# EasyEDA schematic 1-Schematic_P1_ElectricalManagement_MechanicalRelay.json
TITLE: P1_ElectricalManagement_MechanicalRelay; REV: 1.0; Date: 2019-07-15; Sheet: 1/1; Drawn By: Francisco Moreno; Company: Universidad de Sevilla
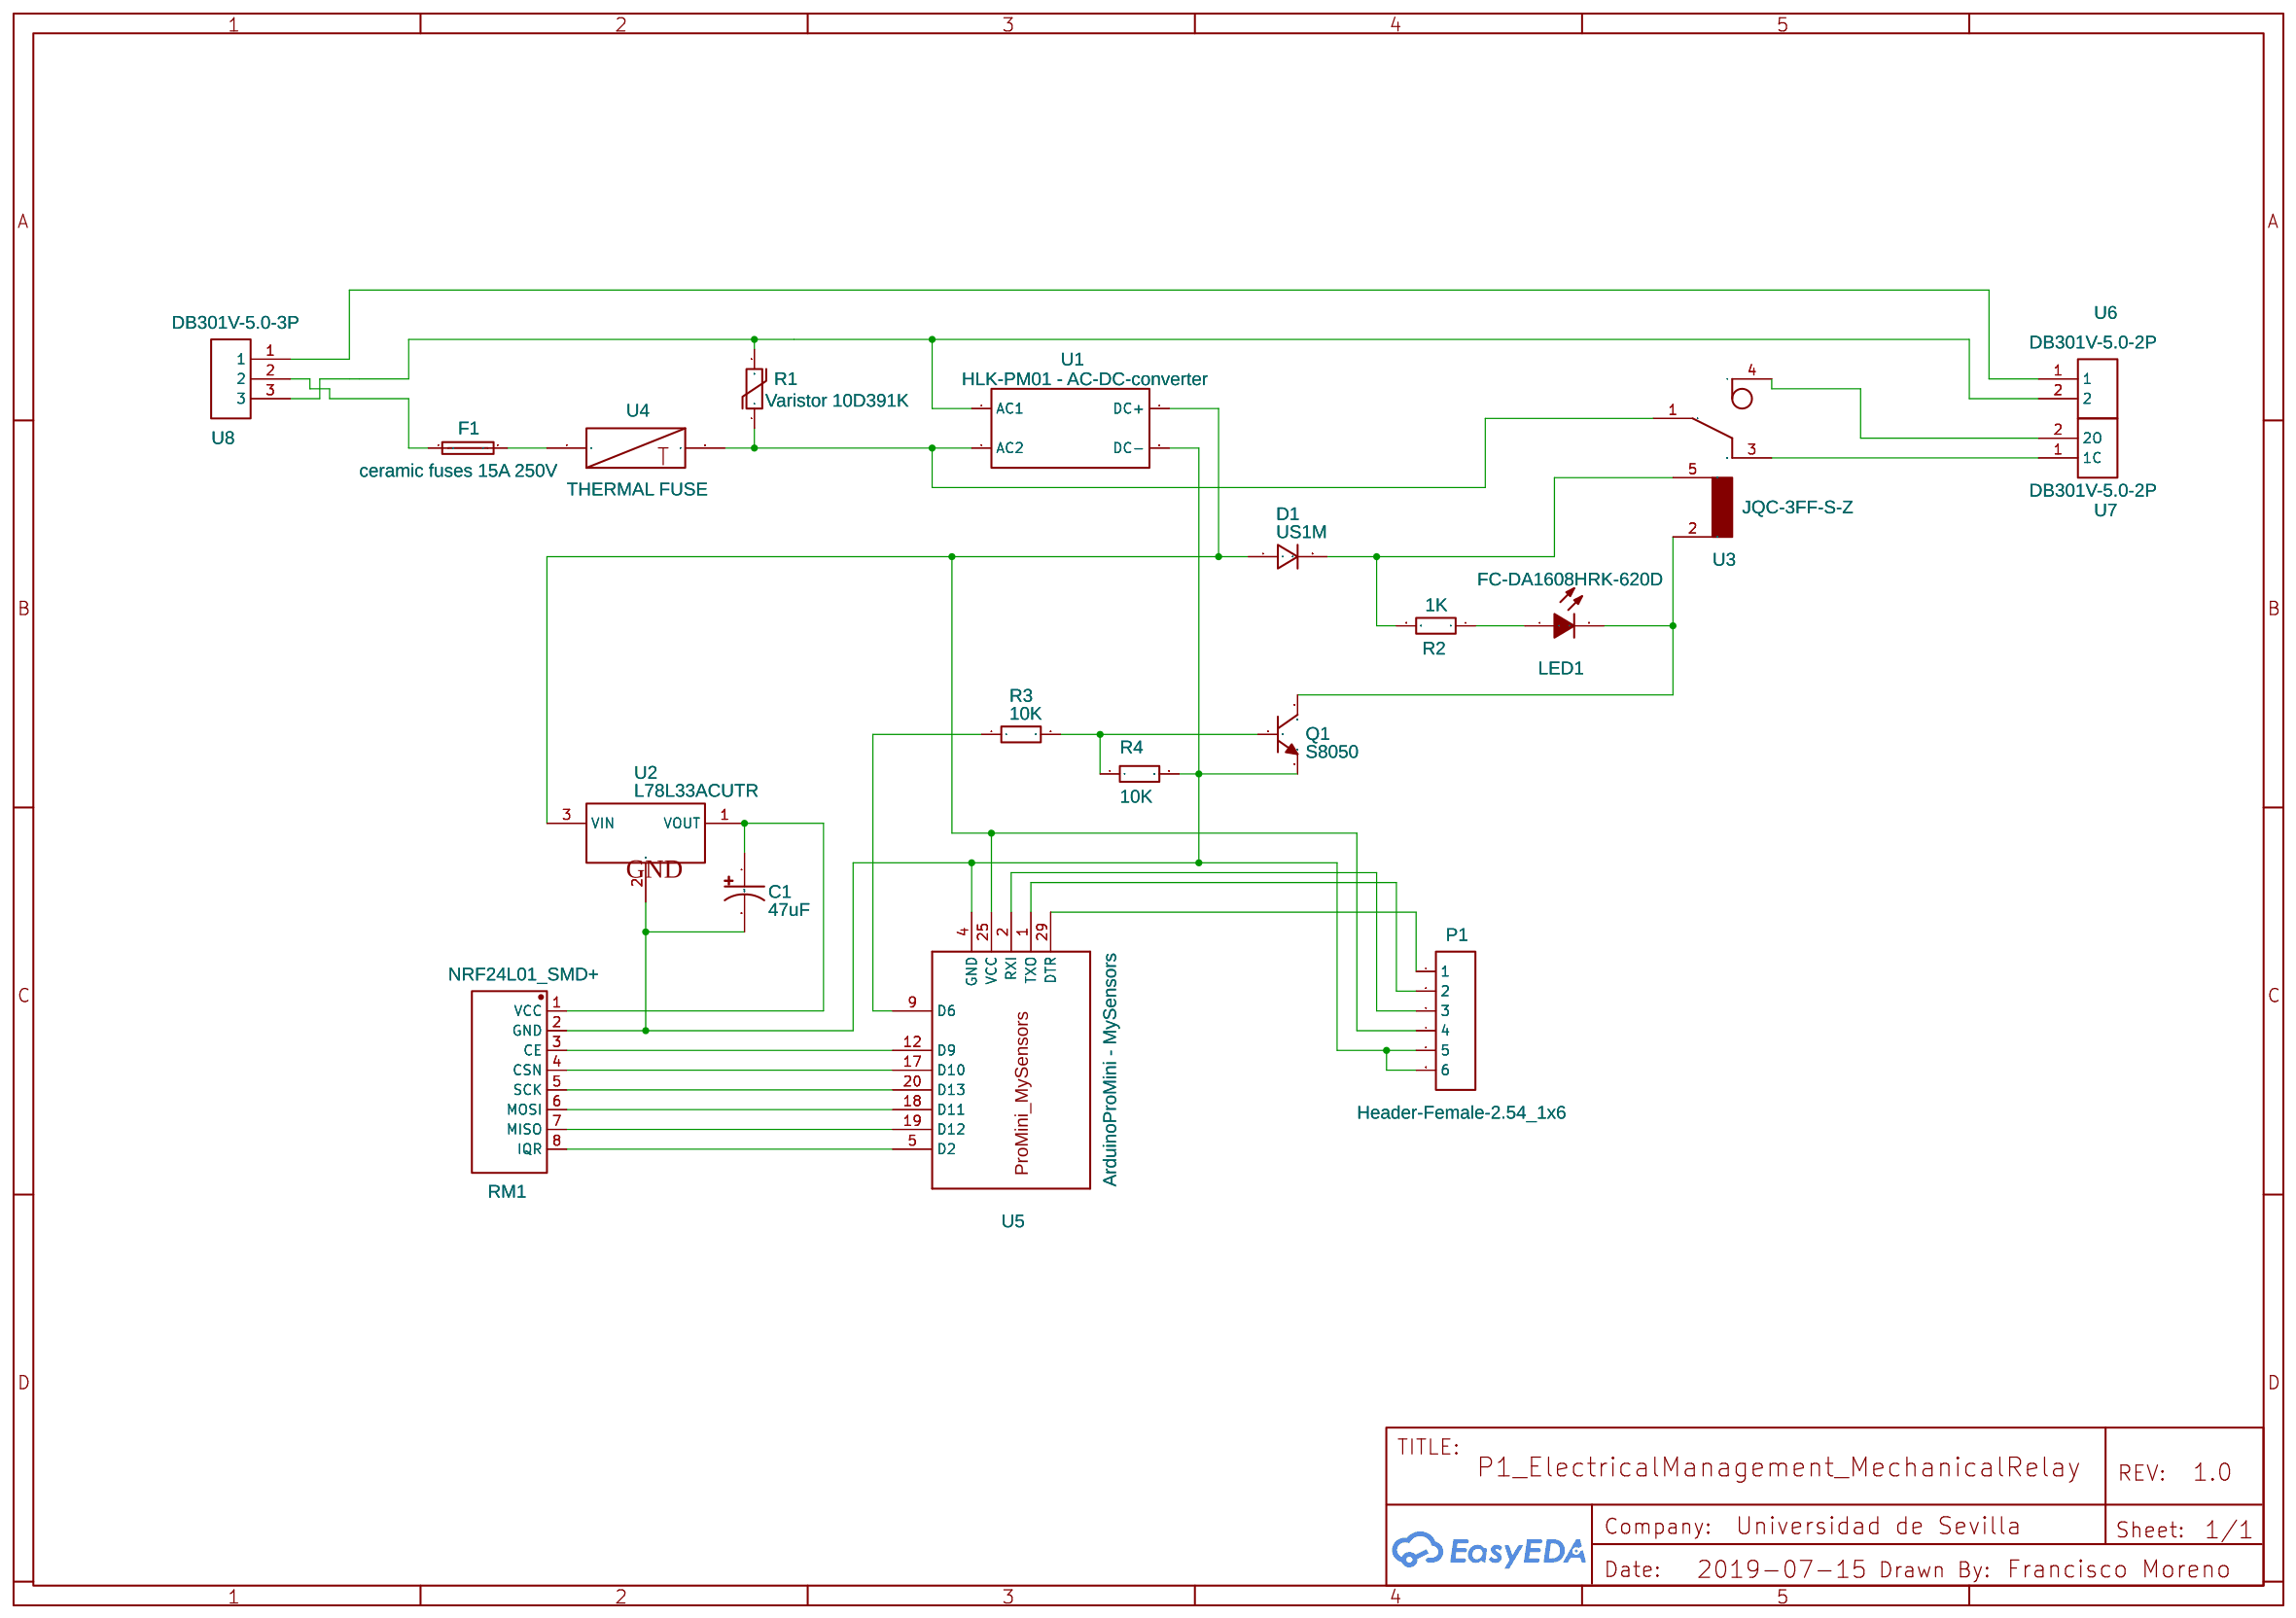
[diagram p0: schematic sheet]

## Parts
C1  47uF  [SMD,6.3X5.4MM]
D1  US1M  [SMA(DO-214AC)]
F1  ceramic fuses 15A 250V  [F-DIP-22.5X5.8]
LED1  FC-DA1608HRK-620D  [LED-0603]
P1  Header-Female-2.54_1x6  [HDR-6X1/2.54]
Q1  S8050  [SOT-23(SOT-23-3)]
R1  Varistor 10D391K  [VDR-7.5-12.5X8]
R2  1K  [BEAD_0805]
R3  10K  [0805]
R4  10K  [0805]
RM1  NRF24L01_SMD+  [NRF24L01_SMD+]
U1  HLK-PM01 - AC-DC-converter  [HLK-PM01]
U2  L78L33ACUTR  [SOT-89]
U3  JQC-3FF-S-Z  [JQC-3FF-S-Z]
U4  THERMAL FUSE  [THERMAL FUSE]
U5  ArduinoProMini - MySensors  [PROMINI_MYSENSORS_PINS]
U6  DB301V-5.0-2P  [WJ301V-5.00-2P]
U7  DB301V-5.0-2P  [WJ301V-5.00-2P]
U8  DB301V-5.0-3P  [WJ301V-5.00-3P]

## Library data of the parts
C1 = RT1V470M0605: Supplier: LCSC; Supplier Part: C267463; Manufacturer: ROQANG; Contributor: LCSC
D1 = -: Supplier Part: C9808; Supplier: LCSC; Manufacturer: Semtech; Manufacturer Part: LL4148; Contributor: LCSC
F1 = -: Supplier: LCSC; Manufacturer Part: 20N-150H; Manufacturer: HOLLY; image: //image.lceda.cn/szlcsc/C60547.jpg; Supplier Part: C377301
LED1 = -: Supplier: LCSC; Manufacturer: NATIONSTAR; Supplier Part: C84263
P1 = -: Supplier: LCSC; Manufacturer: BOOMELE; Manufacturer Part: Female header 1*6p; Supplier Part: C40877
Q1 = -: Supplier: LCSC; Manufacturer: Hottech; Contributor: LCSC; Supplier Part: C181158; LCSC Assembly: Yes; SMT Type: Extend
R1 = 10D391K_C233184: Supplier: LCSC; Supplier Part: C233184; Manufacturer: Shenzhen Ruilongyuan Elec; Manufacturer Part: 10D391K; Contributor: LCSC
R2 = 1206W4J0102T5E: Supplier: LCSC; Manufacturer: UniOhm; Supplier Part: C1469
R3 R4 = RS-05K103JT: Supplier: LCSC; Manufacturer: FH; Supplier Part: C115295
RM1 = -: Supplier: LCSC; Manufacturer Part: ?; Contributor: tiana
U1 = -: sourceId: u1BzxTRca; Manufacturer Part: ?
U2 = -: Supplier: LCSC; Manufacturer: STMicroelectronics; image: //image.lceda.cn/szlcsc/C14170.jpg; Supplier Part: C14170; LCSC Assembly: Yes; SMT Type: Extend
U3 = -: Contributor: EasyEDA; link: https://www.alibaba.com/product-detail/relay-types-JQC-3FF-S-Z_60682592473.html
U4 = -: Supplier Part: DF72S; Supplier: ESKA; Contributor: j.arts87; Link: https://www.alibaba.com/product-detail/DF72S-72c-thermal-fuse-16a-250v_60653461804.html?spm=a2700.7724857.normalList.2.2c201c68Es4QP8&s=p
U5 = -: Manufacturer Part: New SchematicLib; Contributor: buinskii; Link: https://robotdyn.ru/catalog/arduino/boards/promini_atmega328p_compatible_with_arduino_mini.html
U6 U7 = -: Manufacturer: DIBO; Supplier: LCSC; Supplier Part: C395882; link: https://datasheet.lcsc.com/szlcsc/1906111836_DIBO-DB301V-5-0-3P_C395881.pdf; Contributor: framortej
U8 = -: Manufacturer: DIBO; Supplier: LCSC; Supplier Part: C395881; link: https://datasheet.lcsc.com/szlcsc/1906111836_DIBO-DB301V-5-0-3P_C395881.pdf; Contributor: alexgubanow

## Nets
Net-(C1-1): C1.1 RM1.1(VCC) U2.1(VOUT)
Net-(C1-2): C1.2 P1.5 P1.6 Q1.2 R4.2 RM1.2(GND) U1.3(DC-) U2.2(GND) U5.4(GND)
Net-(D1-1): D1.1 P1.4 U1.4(DC+) U2.3(VIN) U5.25(VCC)
Net-(D1-2): D1.2 R2.2 U3.5
Net-(F1-1): F1.1 U8.2
Net-(F1-2): F1.2 U4.1
Net-(LED1-1): LED1.1(A) R2.1
Net-(LED1-2): LED1.2(K) Q1.3 U3.2
Net-(P1-1): P1.1 U5.29(DTR)
Net-(P1-2): P1.2 U5.1(TXO)
Net-(P1-3): P1.3 U5.2(RXI)
Net-(Q1-1): Q1.1 R3.2 R4.1
Net-(R1-1): R1.1 U1.2(AC2) U3.1 U4.2
Net-(R1-2): R1.2 U1.1(AC1) U6.2 U8.3
Net-(R3-1): R3.1 U5.9(D6)
Net-(RM1-3): RM1.3(CE) U5.12(D9)
Net-(RM1-4): RM1.4(CSN) U5.17(D10)
Net-(RM1-5): RM1.5(SCK) U5.20(D13)
Net-(RM1-6): RM1.6(MOSI) U5.18(D11)
Net-(RM1-7): RM1.7(MISO) U5.19(D12)
Net-(RM1-8): RM1.8(IQR) U5.5(D2)
Net-(U3-3): U3.3 U7.1(1C)
Net-(U3-4): U3.4 U7.2(2O)
Net-(U6-1): U6.1 U8.1
